# Altium schematic sheet Power.SchDoc: =Name-1str
size 420 x 297 mm; SheetNumber: номер страницы; Вид изделия: Документация; Раздел: Документация; Код документа: Э3; Вид документа: Схема электрическая принципиальная; Класс документа: Конструкторский документ; Создавать изделие в PLM: Yes; DocumentCode: Э3; DocumentView: Схема электрическая принципиальная; DocumentClass: Конструкторский документ; ProductView: Документация
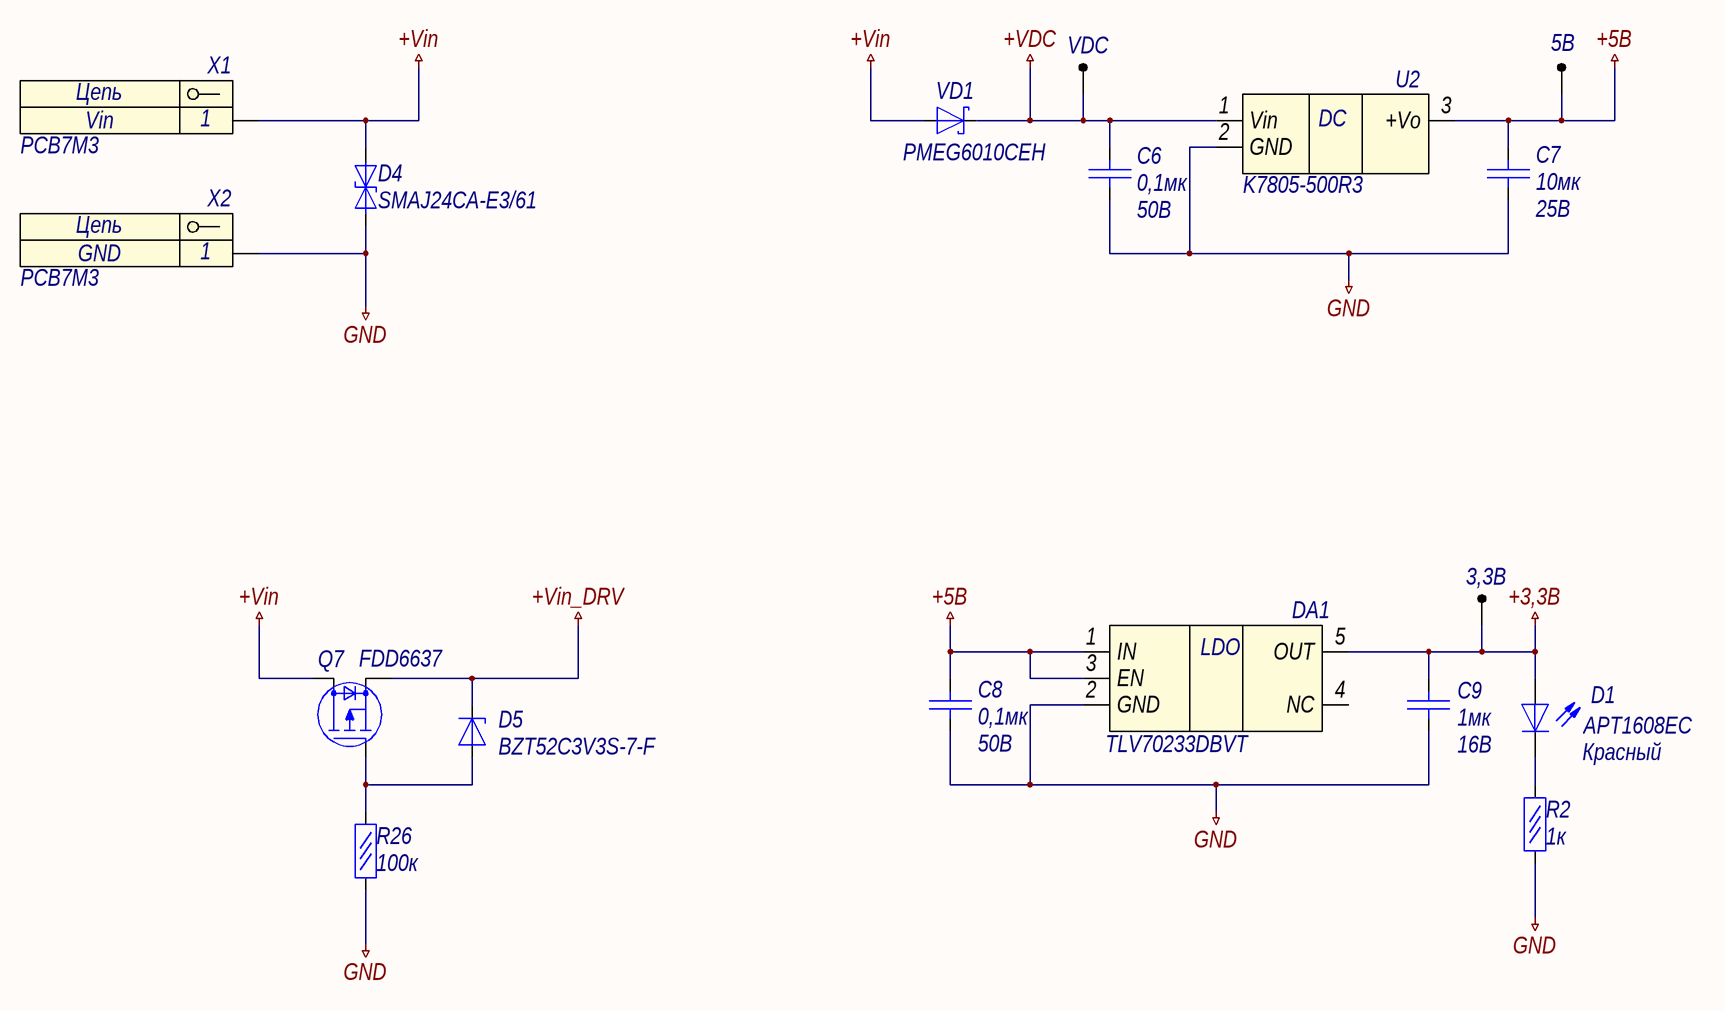
[diagram p0: Power.SchDoc]

## Parts
3,3В  "1"  [0.5 x 1_round]  (value not drawn)
5В  "1"  [0.5 x 1_round]  (value not drawn)
C6  Voltage: 50В  [C0805_AA]  (hidden comment: 0,1мк)
C7  Voltage: 25В  [C0805_AA]  (hidden comment: 10мк)
C8  Voltage: 50В  [C0805_AA]  (hidden comment: 0,1мк)
C9  Voltage: 16В  [C0805_AA]  (hidden comment: 1мк)
D1  APT1608EC  Vr: Красный  [D0603_A]
D4  SMAJ24CA-E3/61
D5  BZT52C3V3S-7-F  [SOT23-2_A]
DA1  TLV70233DBVT
Q7  FDD6637  [SOT23-3_A]
R2  1к  [R1206]
R26  100к  [R1206]
U2  K7805-500R3
VD1  PMEG6010CEH  [SOD123_A]
VDC  "1"  [0.5 x 1_round]  (value not drawn)
X1  PCB7M3
X2  PCB7M3

## Nets
+3,3В: 3,3В.1 C9.2 D1.1(Анод) DA1.5(OUT)
+5В: 5В.1 C7.2 C8.2 DA1.1(IN) DA1.3(EN) U2.3(+Vo)
+VDC: C6.2 U2.1(Vin) VD1.1(K) VDC.1
+Vin: D4.2(K) Q7.3(D) VD1.2(A) X1.1
+Vin_DRV: D5.1(K) Q7.2(S)
GND: C6.1 C7.1 C8.1 C9.1 D4.1(A) DA1.2(GND) R2.1 R26.1 U2.2(GND) X2.1
NetD1_2: D1.2(Катод) R2.2
NetD5_2: D5.2(A) Q7.1(G) R26.2

Not connected (* = marked no-connect by the designer): DA1 4(NC)

## Notes on the sheet
- Подп. и дата
- Инв. № дубл.
- Взам. инв. №
- Инв. № подл.
- Лист
- Изм.
- № докум.
- Подп.
- Дата
- Копировал
- Формат
- А3
- (in symbol K78xx-500R3) DC
- (in symbol TLV702) LDO
- (in symbol x1-k) Цепь

## Library data of the parts
3,3В 5В VDC = TestPoint: Test point; Comment_1: "1"
C6 C8 = Конденсатор кер.: Name: CC0603KRX7R9BB104; Value: 0,1мк
C7 = Конденсатор кер.: Name: CC1206KKX5R8BB106; Value: 10мк
C9 = Конденсатор кер.: Name: CC0603KRX7R7BB105; Value: 1мк
D1 = LED_R: Светодиод; Name: APT1608EC
D4 = diode-2tvs: Ограничитель напряжения односторонний; Name: SMAJ24CA-E3/61
D5 = DiodeZener: Стабилитрон; Name: BZT52C3V3S-7-F
DA1 = TLV702: LDO Regulator
Q7 = P-MOSFET: Name: FDD6637; Vds: *; Vgs: *; Ids: *
R2 = Резистор  0,05Вт: Резистор 0,05Вт; Name: RC0603FR-071KL; Power rating: 0,05Вт; Value: 1к
R26 = Резистор  0,05Вт: Резистор 0,05Вт; Name: RC0603FR-07100KL; Power rating: 0,05Вт; Value: 100к
U2 = K78xx-500R3: DC/DC преобразователь неизолированный
VD1 = DiodeSchottky: Диод Шоттки; Name: PMEG6010CEH
X1 = x1-k: Разъем - 1 конт. клемма; Contact_1: Vin; Name: PCB7M3
X2 = x1-k: Разъем - 1 конт. клемма; Contact_1: GND; Name: PCB7M3